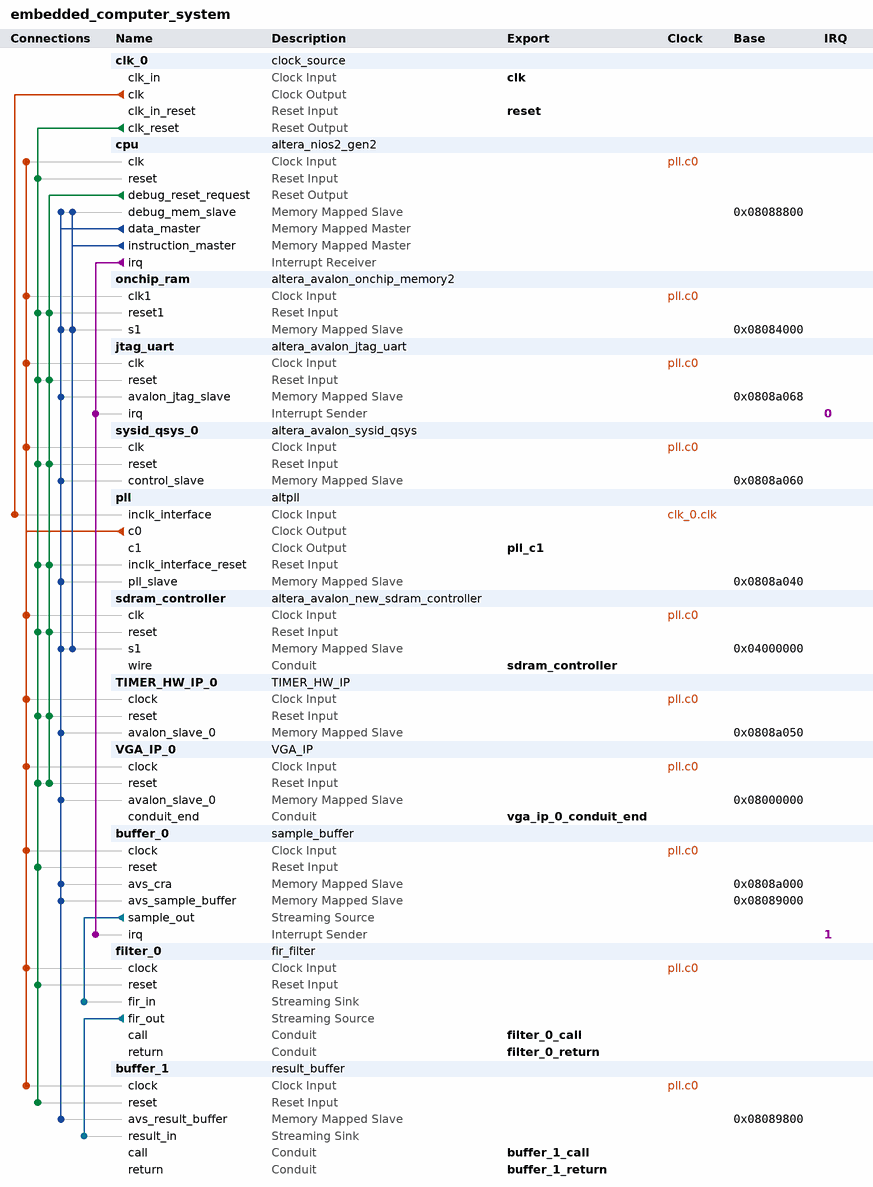
[diagram p0: system contents]
# Platform Designer (Qsys) system embedded_computer_system, MAX 10 10M50DAF484C7G
# Parameters at their usual value, and those the tool derives, are not listed.
package require -exact qsys 18.1
create_system embedded_computer_system
set_project_property DEVICE_FAMILY {MAX 10}
set_project_property DEVICE 10M50DAF484C7G

add_instance clk_0 clock_source 18.1
set_instance_parameter_value clk_0 clockFrequency 50000000

add_instance cpu altera_nios2_gen2 18.1
set_instance_parameter_value cpu dcache_size 2048
set_instance_parameter_value cpu exceptionSlave sdram_controller.s1
set_instance_parameter_value cpu icache_size 4096
set_instance_parameter_value cpu impl Tiny
set_instance_parameter_value cpu resetSlave sdram_controller.s1

add_instance onchip_ram altera_avalon_onchip_memory2 18.1
set_instance_parameter_value onchip_ram dataWidth 32
set_instance_parameter_value onchip_ram dualPort false
set_instance_parameter_value onchip_ram initMemContent false
set_instance_parameter_value onchip_ram initializationFileName onchip_mem.hex
set_instance_parameter_value onchip_ram memorySize 16384

add_instance jtag_uart altera_avalon_jtag_uart 18.1
set_instance_parameter_value jtag_uart simInteractiveOptions NO_INTERACTIVE_WINDOWS

add_instance sysid_qsys_0 altera_avalon_sysid_qsys 18.1
set_instance_parameter_value sysid_qsys_0 id 1

add_instance pll altpll 18.1
set_instance_parameter_value pll CLK0_DIVIDE_BY 1
set_instance_parameter_value pll CLK0_MULTIPLY_BY 1
set_instance_parameter_value pll CLK1_DIVIDE_BY 1
set_instance_parameter_value pll CLK1_DUTY_CYCLE 50
set_instance_parameter_value pll CLK1_MULTIPLY_BY 1
set_instance_parameter_value pll CLK1_PHASE_SHIFT -5000
set_instance_parameter_value pll CLK2_DIVIDE_BY 1
set_instance_parameter_value pll CLK2_DUTY_CYCLE 50
set_instance_parameter_value pll CLK2_MULTIPLY_BY 2
set_instance_parameter_value pll CLK2_PHASE_SHIFT 0
set_instance_parameter_value pll INCLK0_INPUT_FREQUENCY 20000
set_instance_parameter_value pll PORT_ARESET PORT_UNUSED
set_instance_parameter_value pll PORT_LOCKED PORT_UNUSED
set_instance_parameter_value pll PORT_clk1 PORT_USED
set_instance_parameter_value pll PORT_clk2 PORT_USED
set_instance_parameter_value pll PORT_clk3 PORT_UNUSED

add_instance sdram_controller altera_avalon_new_sdram_controller 18.1
set_instance_parameter_value sdram_controller TAC 5.4
set_instance_parameter_value sdram_controller TRCD 15.0
set_instance_parameter_value sdram_controller TRP 15.0
set_instance_parameter_value sdram_controller casLatency 3
set_instance_parameter_value sdram_controller columnWidth 10
set_instance_parameter_value sdram_controller dataWidth 16
set_instance_parameter_value sdram_controller generateSimulationModel false
set_instance_parameter_value sdram_controller model single_Micron_MT48LC4M32B2_7_chip
set_instance_parameter_value sdram_controller numberOfBanks 4
set_instance_parameter_value sdram_controller numberOfChipSelects 1
set_instance_parameter_value sdram_controller powerUpDelay 100.0
set_instance_parameter_value sdram_controller refreshPeriod 7.8125
set_instance_parameter_value sdram_controller rowWidth 13

add_instance TIMER_HW_IP_0 TIMER_HW_IP 1.1

add_instance VGA_IP_0 VGA_IP 1.4

add_instance buffer_0 sample_buffer 1.0

add_instance filter_0 fir_filter 1.0

add_instance buffer_1 result_buffer 1.0

# connections
add_connection clk_0.clk pll.inclk_interface clock
add_connection pll.c0 buffer_0.clock clock
add_connection pll.c0 buffer_1.clock clock
add_connection pll.c0 cpu.clk clock
add_connection pll.c0 filter_0.clock clock
add_connection pll.c0 jtag_uart.clk clock
add_connection pll.c0 onchip_ram.clk1 clock
add_connection pll.c0 sdram_controller.clk clock
add_connection pll.c0 sysid_qsys_0.clk clock
add_connection pll.c0 TIMER_HW_IP_0.clock clock
add_connection pll.c0 VGA_IP_0.clock clock
add_connection clk_0.clk_reset buffer_0.reset reset
add_connection clk_0.clk_reset buffer_1.reset reset
add_connection clk_0.clk_reset cpu.reset reset
add_connection clk_0.clk_reset filter_0.reset reset
add_connection clk_0.clk_reset jtag_uart.reset reset
add_connection clk_0.clk_reset onchip_ram.reset1 reset
add_connection clk_0.clk_reset pll.inclk_interface_reset reset
add_connection clk_0.clk_reset sdram_controller.reset reset
add_connection clk_0.clk_reset sysid_qsys_0.reset reset
add_connection clk_0.clk_reset TIMER_HW_IP_0.reset reset
add_connection clk_0.clk_reset VGA_IP_0.reset reset
add_connection cpu.debug_reset_request jtag_uart.reset reset
add_connection cpu.debug_reset_request onchip_ram.reset1 reset
add_connection cpu.debug_reset_request pll.inclk_interface_reset reset
add_connection cpu.debug_reset_request sdram_controller.reset reset
add_connection cpu.debug_reset_request sysid_qsys_0.reset reset
add_connection cpu.debug_reset_request TIMER_HW_IP_0.reset reset
add_connection cpu.debug_reset_request VGA_IP_0.reset reset
add_connection cpu.data_master buffer_0.avs_cra avalon
set_connection_parameter_value cpu.data_master/buffer_0.avs_cra baseAddress 0x0808a000
add_connection cpu.data_master buffer_0.avs_sample_buffer avalon
set_connection_parameter_value cpu.data_master/buffer_0.avs_sample_buffer baseAddress 0x08089000
add_connection cpu.data_master buffer_1.avs_result_buffer avalon
set_connection_parameter_value cpu.data_master/buffer_1.avs_result_buffer baseAddress 0x08089800
add_connection cpu.data_master cpu.debug_mem_slave avalon
set_connection_parameter_value cpu.data_master/cpu.debug_mem_slave baseAddress 0x08088800
add_connection cpu.data_master jtag_uart.avalon_jtag_slave avalon
set_connection_parameter_value cpu.data_master/jtag_uart.avalon_jtag_slave baseAddress 0x0808a068
add_connection cpu.data_master onchip_ram.s1 avalon
set_connection_parameter_value cpu.data_master/onchip_ram.s1 baseAddress 0x08084000
add_connection cpu.data_master pll.pll_slave avalon
set_connection_parameter_value cpu.data_master/pll.pll_slave baseAddress 0x0808a040
add_connection cpu.data_master sdram_controller.s1 avalon
set_connection_parameter_value cpu.data_master/sdram_controller.s1 baseAddress 0x04000000
add_connection cpu.data_master sysid_qsys_0.control_slave avalon
set_connection_parameter_value cpu.data_master/sysid_qsys_0.control_slave baseAddress 0x0808a060
add_connection cpu.data_master TIMER_HW_IP_0.avalon_slave_0 avalon
set_connection_parameter_value cpu.data_master/TIMER_HW_IP_0.avalon_slave_0 baseAddress 0x0808a050
add_connection cpu.data_master VGA_IP_0.avalon_slave_0 avalon
set_connection_parameter_value cpu.data_master/VGA_IP_0.avalon_slave_0 baseAddress 0x08000000
add_connection cpu.instruction_master cpu.debug_mem_slave avalon
set_connection_parameter_value cpu.instruction_master/cpu.debug_mem_slave baseAddress 0x08088800
add_connection cpu.instruction_master onchip_ram.s1 avalon
set_connection_parameter_value cpu.instruction_master/onchip_ram.s1 baseAddress 0x08084000
add_connection cpu.instruction_master sdram_controller.s1 avalon
set_connection_parameter_value cpu.instruction_master/sdram_controller.s1 baseAddress 0x04000000
add_connection buffer_0.sample_out filter_0.fir_in avalon_streaming
add_connection filter_0.fir_out buffer_1.result_in avalon_streaming
add_connection cpu.irq buffer_0.irq interrupt
set_connection_parameter_value cpu.irq/buffer_0.irq irqNumber 1
add_connection cpu.irq jtag_uart.irq interrupt
set_connection_parameter_value cpu.irq/jtag_uart.irq irqNumber 0

# exported interfaces
add_interface buffer_1_call conduit end
set_interface_property buffer_1_call EXPORT_OF buffer_1.call
add_interface buffer_1_return conduit end
set_interface_property buffer_1_return EXPORT_OF buffer_1.return
add_interface clk clock sink
set_interface_property clk EXPORT_OF clk_0.clk_in
add_interface filter_0_call conduit end
set_interface_property filter_0_call EXPORT_OF filter_0.call
add_interface filter_0_return conduit end
set_interface_property filter_0_return EXPORT_OF filter_0.return
add_interface pll_c1 clock source
set_interface_property pll_c1 EXPORT_OF pll.c1
add_interface reset reset sink
set_interface_property reset EXPORT_OF clk_0.clk_in_reset
add_interface sdram_controller conduit end
set_interface_property sdram_controller EXPORT_OF sdram_controller.wire
add_interface vga_ip_0_conduit_end conduit end
set_interface_property vga_ip_0_conduit_end EXPORT_OF VGA_IP_0.conduit_end

set_interconnect_requirement {$system} qsys_mm.clockCrossingAdapter HANDSHAKE
set_interconnect_requirement {$system} qsys_mm.enableEccProtection FALSE
set_interconnect_requirement {$system} qsys_mm.insertDefaultSlave FALSE
set_interconnect_requirement {$system} qsys_mm.maxAdditionalLatency 1

save_system embedded_computer_system.qsys
